# Altium project Fri3D_2018_01.PrjPcb
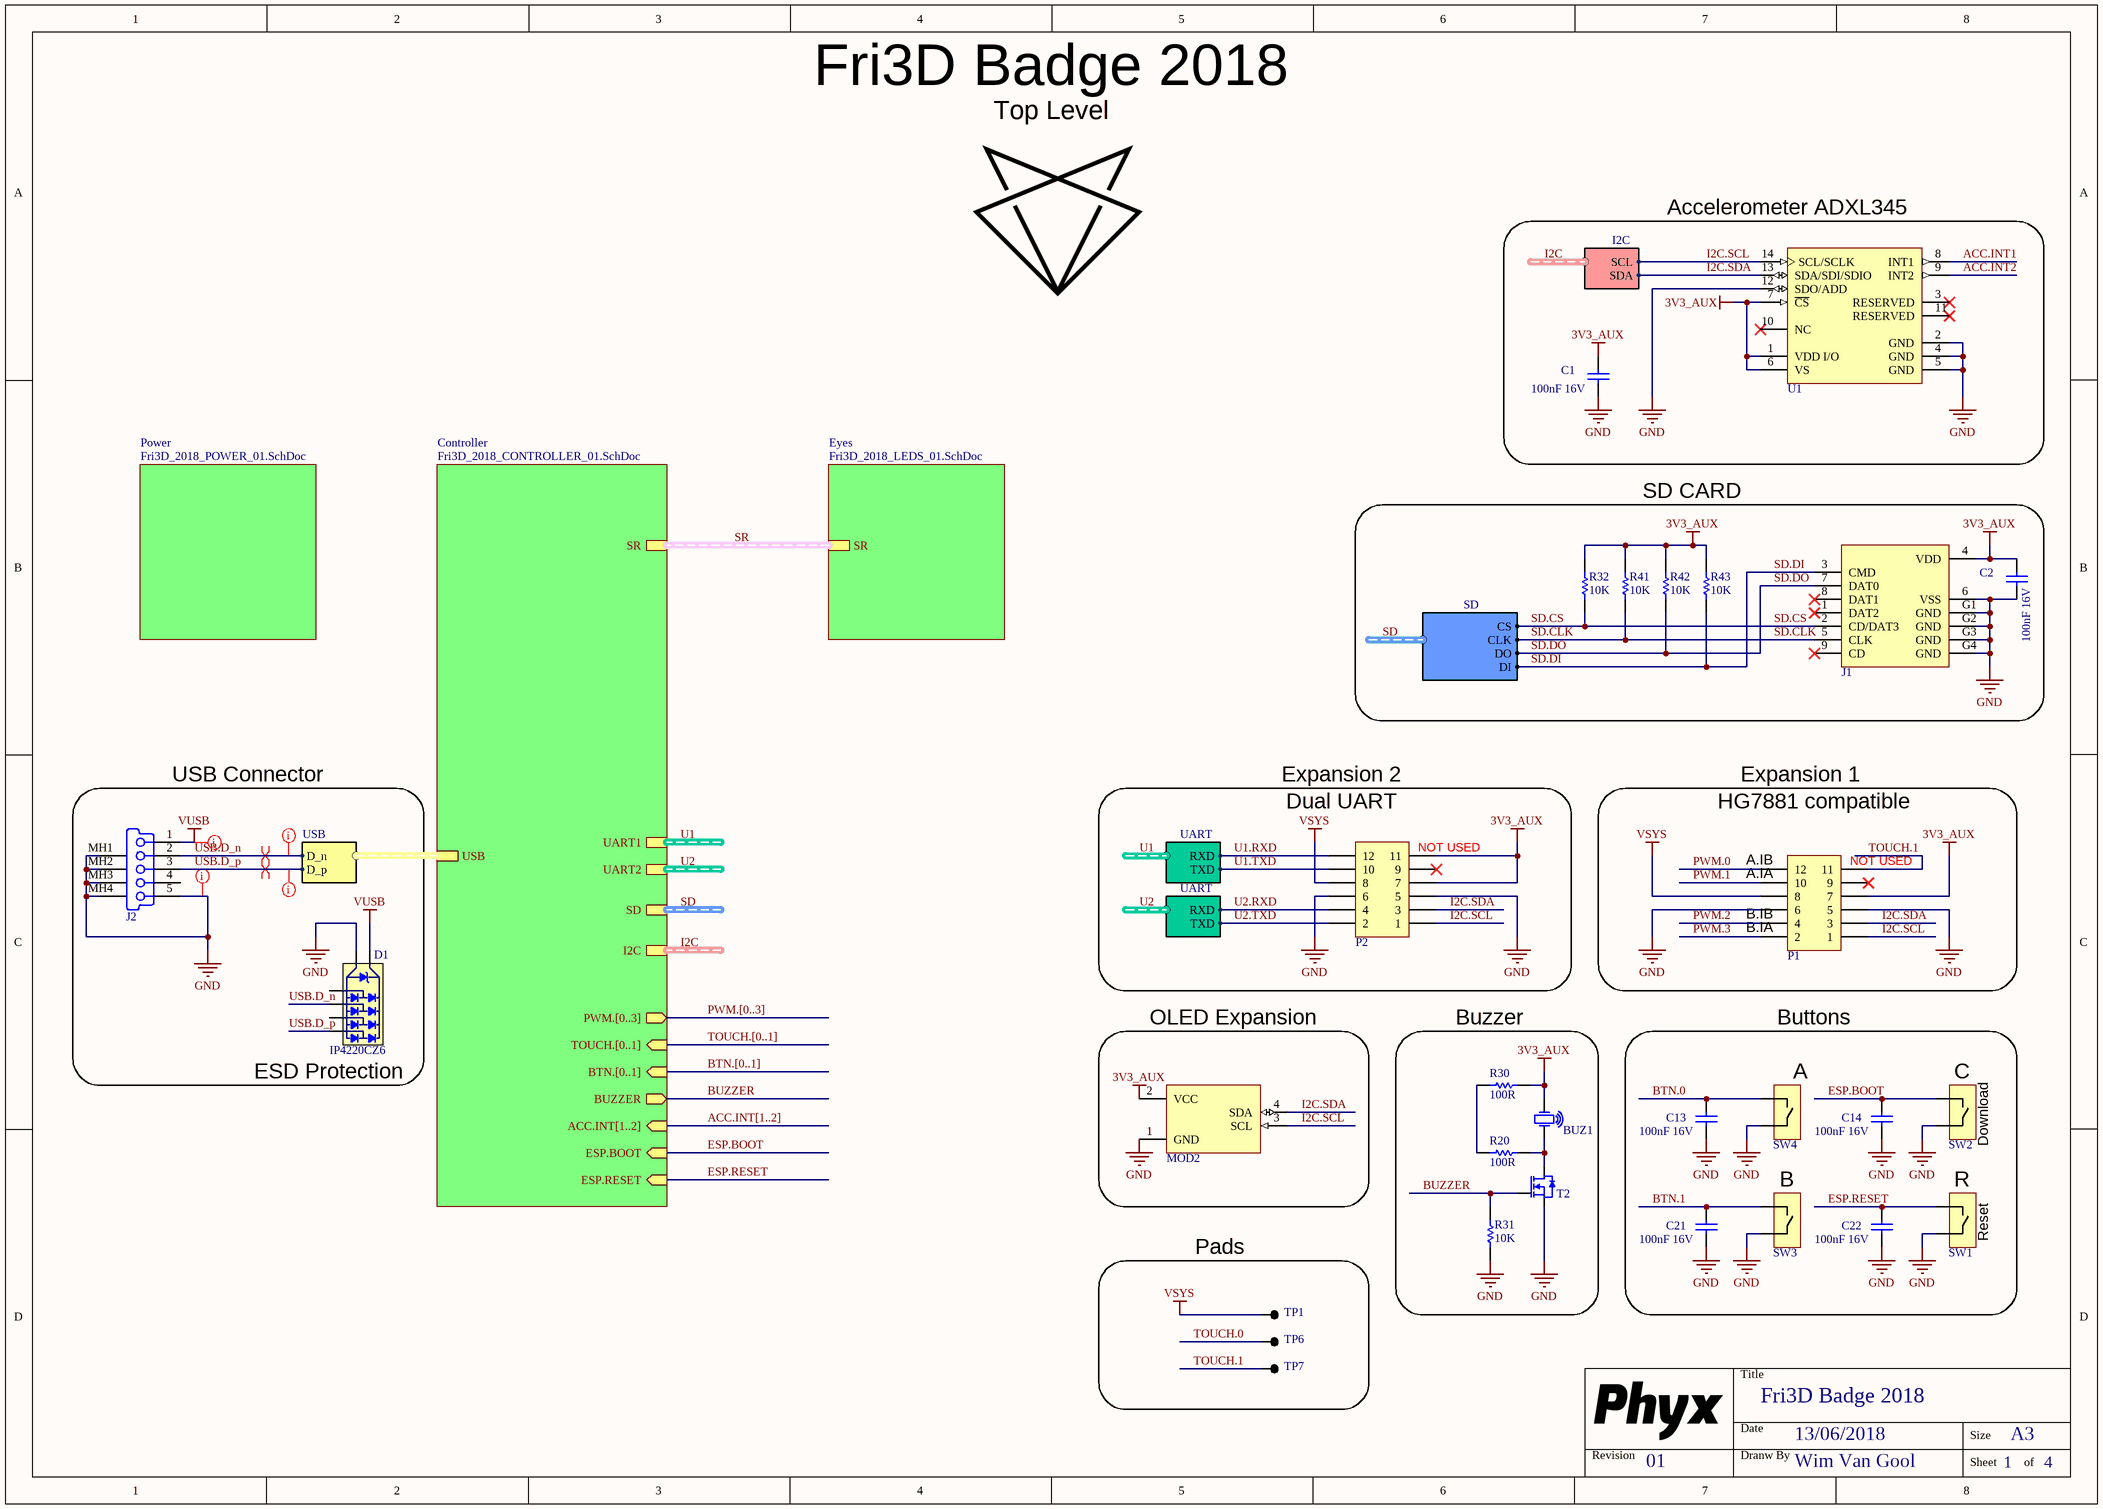
[diagram p0: Fri3D_2018_01.SchDoc]
PCB_ENGINEER: WimVG; PCB_REV: 01; PCB_TITLE: Fri3D Badge 2018
4 sheets, 170 parts. Net scope: hierarchical (ports join the sheet entries above them; power ports are global).
Board file: Fri3D_2018_01.PcbDoc
Sheets:
  Fri3D_2018_01.SchDoc
    Controller = Fri3D_2018_CONTROLLER_01.SchDoc
    Eyes = Fri3D_2018_LEDS_01.SchDoc
    Power = Fri3D_2018_POWER_01.SchDoc

## Sheet Fri3D_2018_01.SchDoc: Fri3D Badge 2018
size A3; Date: 13/06/2018; DrawnBy: Wim Van Gool; DocumentNumber: 1; Revision: 01; SheetNumber: 1; SheetTotal: 4

### Parts
BUZ1  12x12x3mm Piezo Buzzer Transducer 81dB  [CUI_CMT-1203-SMT]  (value not drawn)
C1  value 100nF 16V  [C0603_N]
C2  value 100nF 16V  [C0603_N]
C13  value 100nF 16V  [C0603_N]
C14  value 100nF 16V  [C0603_N]
C21  value 100nF 16V  [C0603_N]
C22  value 100nF 16V  [C0603_N]
D1  value IP4220CZ6  [NXP_SOT457]  (hidden comment: TVS Diode Dual USB)
J1  Micro SD PiPo Push-Push  [TFP09-2-12B]  (value not drawn)
J2  Amphenol FCI 10118194-0001LF Micro USB 1.8A TH Lock  [FCI_10118194-0001LF]  (value not drawn)
MOD2  SSD1306 based 128x64 OLED, I2C, module  [OLED_MOD_0.96_I2C]  (value not drawn)
P1  Receptacle 6x2 SMD low profile  [WE_610312243021_POST]  (value not drawn)
P2  Receptacle 6x2 SMD low profile  [WE_610312243021_POST]  (value not drawn)
R20  value 100R  [R0603_N]  (hidden comment: RESISTOR)
R30  value 100R  [R0603_N]  (hidden comment: RESISTOR)
R31  value 10K  [R0603_N]  (hidden comment: RESISTOR)
R32  value 10K  [R0603_N]  (hidden comment: RESISTOR)
R41  value 10K  [R0603_N]  (hidden comment: RESISTOR)
R42  value 10K  [R0603_N]  (hidden comment: RESISTOR)
R43  value 10K  [R0603_N]  (hidden comment: RESISTOR)
SW1  4.5x4.5mm tact SMD H3,8mm  [WE_430181038816]  (value not drawn)
SW2  4.5x4.5mm tact SMD H3,8mm  [WE_430181038816]  (value not drawn)
SW3  4.5x4.5mm tact SMD H3,8mm  [WE_430181038816]  (value not drawn)
SW4  4.5x4.5mm tact SMD H3,8mm  [WE_430181038816]  (value not drawn)
T2  0.2A N-Ch MOSFET Vgs 3.2  [SOT23-3]  (value not drawn)
TP1  TEST_PAD  [TP_0.8mm]  (value not drawn)
TP6  TEST_PAD  [TP_0.8mm]  (value not drawn)
TP7  TEST_PAD  [TP_0.8mm]  (value not drawn)
U1  3-Axis, ±2 g/±4 g/±8 g/±16 g Digital Accelerometer  [AD_CC-14-1]  (value not drawn)

### Blocks framed on the sheet
Accelerometer ADXL345: C1 U1
SD CARD: C2 J1 R32 R41-R43
OLED Expansion: MOD2
Buzzer: BUZ1 R20 R30 R31 T2
Pads: TP1 TP6 TP7

### Sub-sheets
Controller = Fri3D_2018_CONTROLLER_01.SchDoc: SR (harness Shift Register), USB (harness USB), PWM.[0..3] (out), I2C (harness I2C), SD (harness SD), TOUCH.[0..1] (in), BUZZER (out), BTN.[0..1] (in), ACC.INT[1..2] (in), ESP.RESET (in), UART2 (harness UART), UART1 (harness UART), ESP.BOOT (in)
Eyes = Fri3D_2018_LEDS_01.SchDoc: SR (harness Shift Register)
Power = Fri3D_2018_POWER_01.SchDoc: no entries

### Harnesses
USB: D_p, D_n
I2C: SDA, SCL
SD: CS, CLK, DO, DI
UART: TXD, RXD

### Nets
3V3_AUX: BUZ1.1(OSC1) C1.1 C2.1 J1.4(VDD) MOD2.2(VCC) P1.7 P2.7 P2.11 R30.1 R32.1 R41.1 R42.1 R43.1 U1.1(VDD_I/O) U1.6(VS) U1.7(~{CS})
GND: C1.2 C2.2 C13.2 C14.2 C21.2 C22.2 D1.2(GND) J1.6(VSS) J1.G1(GND) J1.G2(GND) J1.G3(GND) J1.G4(GND) J2.5(GND) J2.MH1(Tab) J2.MH2(Tab) J2.MH3(Tab) J2.MH4(Tab) MOD2.1(GND) P1.5 P1.6 P2.5 P2.6 R31.2 SW1.2 SW2.2 SW3.2 SW4.2 T2.2(S) U1.2(GND) U1.4(GND) U1.5(GND) U1.12(SDO/ADD)
VSYS: P1.8 P2.8 TP1.1
VUSB: D1.5(VBus) J2.1(V_BUS_(5V))
ACC.INT1: U1.8(INT1)
ACC.INT2: U1.9(INT2)
BTN.0: C13.1 SW4.1
BTN.1: C21.1 SW3.1
BUZZER: R31.1 T2.1(G) ; sheet Controller/BUZZER
ESP.BOOT: C14.1 SW2.1 ; sheet Controller/ESP.BOOT
ESP.RESET: C22.1 SW1.1 ; sheet Controller/ESP.RESET
I2C.SCL: MOD2.3(SCL) P1.1 P2.1 U1.14(SCL/SCLK) ; sheet Controller/I2C.SCL
I2C.SDA: MOD2.4(SDA) P1.3 P2.3 U1.13(SDA/SDI/SDIO) ; sheet Controller/I2C.SDA
PWM.0: P1.12
PWM.1: P1.10
PWM.2: P1.4
PWM.3: P1.2
SD.CLK: J1.5(CLK) R41.2 ; sheet Controller/SD.CLK
SD.CS: J1.2(CD/DAT3) R32.2 ; sheet Controller/SD.CS
SD.DI: J1.3(CMD) R43.2 ; sheet Controller/SD.DI
SD.DO: J1.7(DAT0) R42.2 ; sheet Controller/SD.DO
TOUCH.0: TP6.1
TOUCH.1: P1.11 TP7.1
U1.RXD: P2.12 ; sheet Controller/UART1.RXD
U1.TXD: P2.10 ; sheet Controller/UART1.TXD
U2.RXD: P2.4 ; sheet Controller/UART2.RXD
U2.TXD: P2.2 ; sheet Controller/UART2.TXD
USB.D_n: D1.1 J2.2(D-) ; sheet Controller/USB.D_n
USB.D_p: D1.6 J2.3(D+) ; sheet Controller/USB.D_p
NetBUZ1_2: BUZ1.2(OSC2) R20.1 T2.3(D)
NetR20_2: R20.2 R30.2

Not connected (* = marked no-connect by the designer): D1 3 4; J1 1(DAT2)* 8(DAT1)* 9(CD)*; J2 4(NC); P1 9*; P2 9*; U1 3(RESERVED)* 10(NC)* 11(RESERVED)*

### Buses and harness runs
bus ACC.INT[1..2] = sheet Controller/ACC.INT[1..2]
bus BTN.[0..1] = sheet Controller/BTN.[0..1]
bus PWM.[0..3] = sheet Controller/PWM.[0..3]
bus TOUCH.[0..1] = sheet Controller/TOUCH.[0..1]
harness I2C = sheet Controller/I2C
harness SD = sheet Controller/SD
harness SR = sheet Controller/SR = sheet Eyes/SR
harness U1 = sheet Controller/UART1
harness U2 = sheet Controller/UART2

### Layout directives
net class POWER: GND, VUSB
net class 90r: USB.D_n, USB.D_p
differential pair: USB.D_n, USB.D_p

### Notes on the sheet
- Fri3D Badge 2018
- Top Level
- USB Connector
- Expansion 2
- Expansion 1
- (near P2) Dual UART
- (near P2) NOT USED
- HG7881 compatible
- (near P1) A.IB
- (near P1) A.IA
- (near P1) B.IB
- (near P1) NOT USED
- (near P1) B.IA
- Buttons
- (near D1) ESD Protection
- (near SW4) A
- (near SW2) C
- (near SW2) Download
- (near SW3) B
- (near SW1) R
- (near SW1) Reset
- Title
- Revision
- Date
- Dranw By
- Size
- A3
- Sheet
- of

### Library data of the parts
BUZ1 = BUZ # CUI CMT-1203-SMT: Crystal Oscillator; Value: CMT-1203-SMT; Supplier 1: Digikey; Supplier Part Number 1: 102-2197-1-ND; Supplier 2: Aliexpress; Supplier Part Number 2: KLJ-1230
C1 C2 C13 C14 C21 C22 = CAP # 100nF 16V 0603: Capacitor Ceramic
D1 = TVS # IP4220CZ6 Dual USB: =Description; Supplier 1: Farnell; Supplier Part Number 1: 2143248
J1 = MicroSD TFP09-2-12B Push-Push: =Description; Value: TFP09-2-12B; Supplier 1: AliExpress; Supplier Part Number 1: TFP09-2-12B
J2 = USB # Micro B TH Amphenol 10118194-0001LF: Value: 10118194-0001LF; Supplier 1: Farnell; Supplier Part Number 1: 2668482; Supplier 2: Digi-key; Supplier Part Number 2: 609-4618-2-ND
MOD2 = OLED MOD SSD1306 0.96in I2C 128x64: Value: 128x64 I2C OLED; Supplier 1: Aliexpress
P1 P2 = Receptacle # 2.54mm dual row 12way 610312243021: Value: 610312243021; Supplier 1: Wurth; Supplier Part Number 1: 610312243021
R20 R30 = RES # 100R 0603
R31 R32 R41-R43 = RES # 10K 0603: Supplier 1: Farnell; Supplier Part Number 1: 2502397
SW1-SW4 = SW # TACT small 4.5x4.5mm SMD WS-TASV: Value: 430181038816; Supplier 1: Wurth; Supplier Part Number 1: 430181038816
T2 = BSS138 N-Ch MOSFET 0.2A 3.2Vgs 60Vds: Value: BSS138; Supplier 1: Farnell; Supplier Part Number 1: 2432717
TP1 TP6 TP7 = TP # 0.8mm: Value: NO BOM
U1 = ACCELERO # ADXL345: =Description; Value: ADXL345BCCZ; Supplier 1: Farnell; Supplier Part Number 1: 1853935; Supplier 2: Digikey; Supplier Part Number 2: ADXL345BCCZ-ND

## Sheet Fri3D_2018_CONTROLLER_01.SchDoc: Fri3D Badge 2018
size A3; Date: 13/06/2018; DrawnBy: Wim Van Gool; DocumentNumber: 2; Revision: 01; SheetNumber: 2; SheetTotal: 4
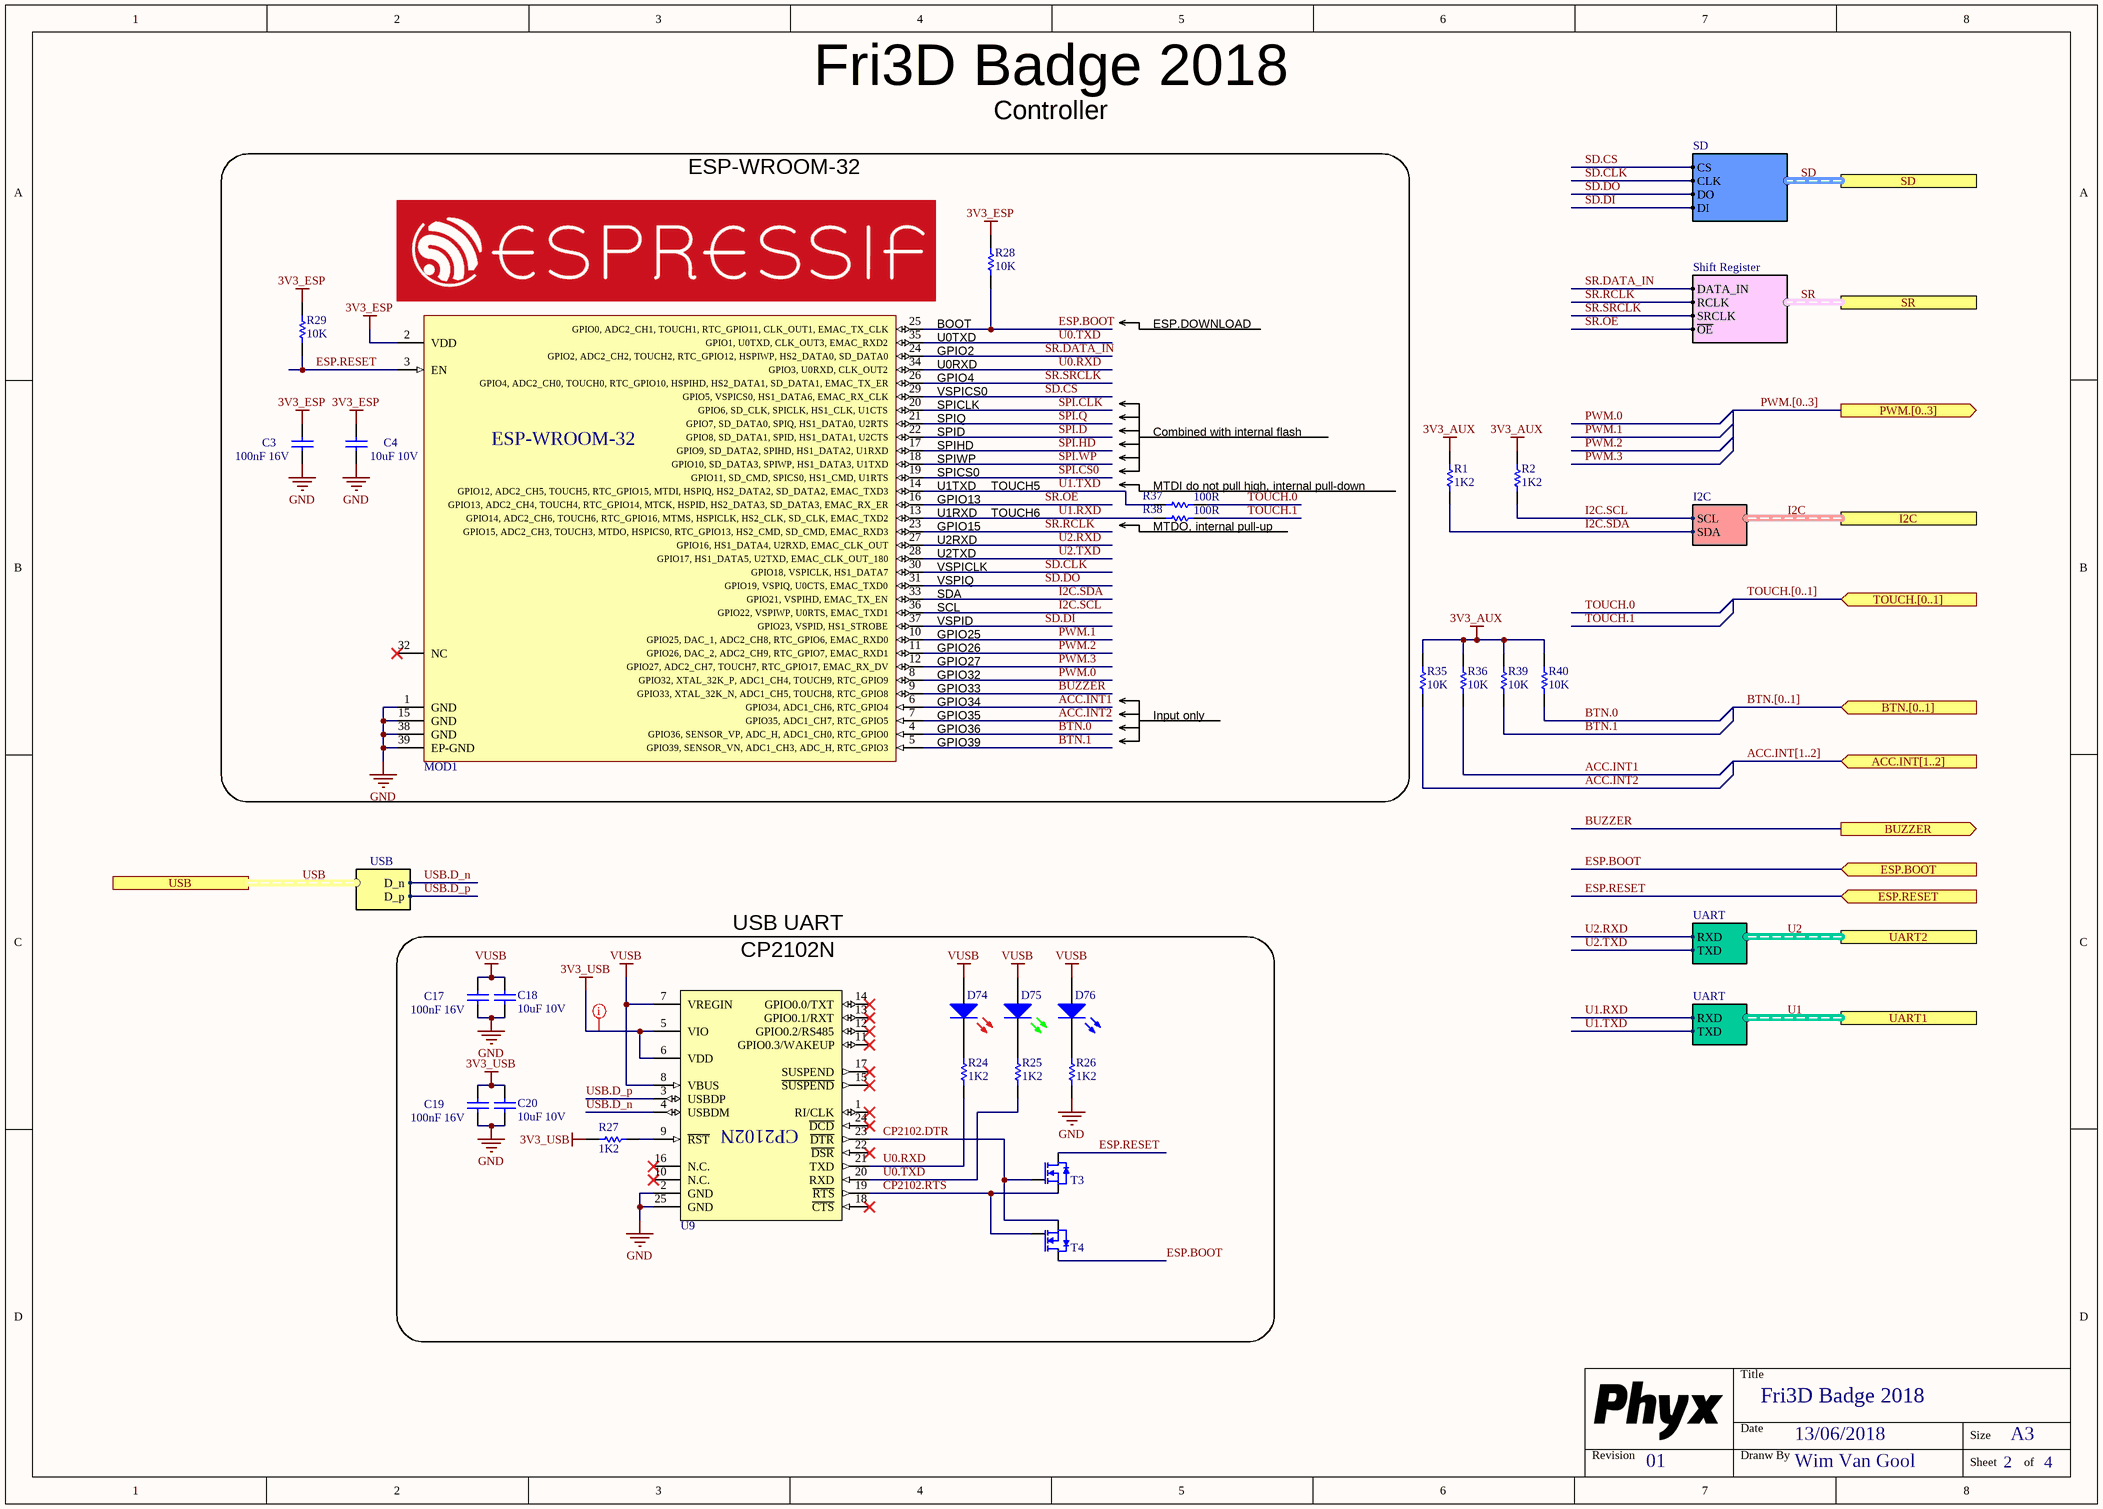
[diagram p1: Fri3D_2018_CONTROLLER_01.SchDoc]

### Parts
C3  value 100nF 16V  [C0603_N]
C4  value 10uF 10V  [C0805_N]  (hidden comment: CAP_CERAMIC)
C17  value 100nF 16V  [C0603_N]
C18  value 10uF 10V  [C0805_N]  (hidden comment: CAP_CERAMIC)
C19  value 100nF 16V  [C0603_N]
C20  value 10uF 10V  [C0805_N]  (hidden comment: CAP_CERAMIC)
D74  Default 0805 Red LED  [LED_0805_RD]  (value not drawn)
D75  Default 0805 Green LED  [LED_0805_GR]  (value not drawn)
D76  Default 0805 Blue LED  [LED_0805_BL]  (value not drawn)
MOD1  ESP-32 based ESP-WROOM-32  [ESP-WROOM-32]  (value not drawn)
R1  value 1K2  [R0603_N]  (hidden comment: RESISTOR)
R2  value 1K2  [R0603_N]  (hidden comment: RESISTOR)
R24  value 1K2  [R0603_N]  (hidden comment: RESISTOR)
R25  value 1K2  [R0603_N]  (hidden comment: RESISTOR)
R26  value 1K2  [R0603_N]  (hidden comment: RESISTOR)
R27  value 1K2  [R0603_N]  (hidden comment: RESISTOR)
R28  value 10K  [R0603_N]  (hidden comment: RESISTOR)
R29  value 10K  [R0603_N]  (hidden comment: RESISTOR)
R35  value 10K  [R0603_N]  (hidden comment: RESISTOR)
R36  value 10K  [R0603_N]  (hidden comment: RESISTOR)
R37  value 100R  [R0603_N]  (hidden comment: RESISTOR)
R38  value 100R  [R0603_N]  (hidden comment: RESISTOR)
R39  value 10K  [R0603_N]  (hidden comment: RESISTOR)
R40  value 10K  [R0603_N]  (hidden comment: RESISTOR)
T3  0.2A N-Ch MOSFET Vgs 3.2  [SOT23-3]  (value not drawn)
T4  0.2A N-Ch MOSFET Vgs 3.2  [SOT23-3]  (value not drawn)
U9  USB to UART 3.3-5V  [QFN_24]  (value not drawn)

### Blocks framed on the sheet
ESP-WROOM-32: C3 C4 MOD1 R28 R29 R37 R38

### Ports
ACC.INT[1..2] (in), BTN.[0..1] (in), BUZZER (out), ESP.BOOT (in), ESP.RESET (in), I2C (harness I2C), PWM.[0..3] (out), SD (harness SD), SR (harness Shift Register), TOUCH.[0..1] (in), UART1 (harness UART), UART2 (harness UART), USB (harness USB)

### Harnesses
Shift Register: DATA_IN, RCLK, SRCLK, ~{OE}
USB: D_p, D_n
I2C: SDA, SCL
SD: CS, CLK, DO, DI
UART: TXD, RXD

### Nets
3V3_AUX: R1.1 R2.1 R35.1 R36.1 R39.1 R40.1
3V3_ESP: C3.1 C4.1 MOD1.2(VDD) R28.1 R29.1
3V3_USB: C19.1 C20.2 R27.1 U9.5(VIO) U9.6(VDD)
GND: C3.2 C4.2 C17.2 C18.1 C19.2 C20.1 MOD1.1(GND) MOD1.15(GND) MOD1.38(GND) MOD1.39(EP-GND) R26.2 U9.2(GND) U9.25(GND)
VUSB: C17.1 C18.2 D74.1(A) D75.1(A) D76.1(A) U9.7(VREGIN) U9.8(VBUS)
ACC.INT1: MOD1.6(GPIO34,_ADC1_CH6,_RTC_GPIO4) R36.2
ACC.INT2: MOD1.7(GPIO35,_ADC1_CH7,_RTC_GPIO5) R35.2
BTN.0: MOD1.4(GPIO36,_SENSOR_VP,_ADC_H,_ADC1_CH0,_RTC_GPIO0) R40.2
BTN.1: MOD1.5(GPIO39,_SENSOR_VN,_ADC1_CH3,_ADC_H,_RTC_GPIO3) R39.2
BUZZER: MOD1.9(GPIO33,_XTAL_32K_N,_ADC1_CH5,_TOUCH8,_RTC_GPIO8) ; port BUZZER
CP2102.DTR: T3.1(G) T4.2(S) U9.23(~{DTR})
CP2102.RTS: T3.2(S) T4.1(G) U9.19(~{RTS})
ESP.BOOT: MOD1.25(GPIO0,_ADC2_CH1,_TOUCH1,_RTC_GPIO11,_CLK_OUT1,_EMAC_TX_CLK) R28.2 T4.3(D) ; port ESP.BOOT
ESP.RESET: MOD1.3(EN) R29.2 T3.3(D) ; port ESP.RESET
I2C.SCL: MOD1.36(GPIO22,_VSPIWP,_U0RTS,_EMAC_TXD1) R2.2 ; port I2C.SCL
I2C.SDA: MOD1.33(GPIO21,_VSPIHD,_EMAC_TX_EN) R1.2 ; port I2C.SDA
PWM.0: MOD1.8(GPIO32,_XTAL_32K_P,_ADC1_CH4,_TOUCH9,_RTC_GPIO9)
PWM.1: MOD1.10(GPIO25,_DAC_1,_ADC2_CH8,_RTC_GPIO6,_EMAC_RXD0)
PWM.2: MOD1.11(GPIO26,_DAC_2,_ADC2_CH9,_RTC_GPIO7,_EMAC_RXD1)
PWM.3: MOD1.12(GPIO27,_ADC2_CH7,_TOUCH7,_RTC_GPIO17,_EMAC_RX_DV)
SD.CLK: MOD1.30(GPIO18,_VSPICLK,_HS1_DATA7) ; port SD.CLK
SD.CS: MOD1.29(GPIO5,_VSPICS0,_HS1_DATA6,_EMAC_RX_CLK) ; port SD.CS
SD.DI: MOD1.37(GPIO23,_VSPID,_HS1_STROBE) ; port SD.DI
SD.DO: MOD1.31(GPIO19,_VSPIQ,_U0CTS,_EMAC_TXD0) ; port SD.DO
SPI.CLK: MOD1.20(GPIO6,_SD_CLK,_SPICLK,_HS1_CLK,_U1CTS)
SPI.CS0: MOD1.19(GPIO11,_SD_CMD,_SPICS0,_HS1_CMD,_U1RTS)
SPI.D: MOD1.22(GPIO8,_SD_DATA1,_SPID,_HS1_DATA1,_U2CTS)
SPI.HD: MOD1.17(GPIO9,_SD_DATA2,_SPIHD,_HS1_DATA2,_U1RXD)
SPI.Q: MOD1.21(GPIO7,_SD_DATA0,_SPIQ,_HS1_DATA0,_U2RTS)
SPI.WP: MOD1.18(GPIO10,_SD_DATA3,_SPIWP,_HS1_DATA3,_U1TXD)
SR.DATA_IN: MOD1.24(GPIO2,_ADC2_CH2,_TOUCH2,_RTC_GPIO12,_HSPIWP,_HS2_DATA0,_SD_DATA0) ; port SR.DATA_IN
SR.~{OE}: MOD1.16(GPIO13,_ADC2_CH4,_TOUCH4,_RTC_GPIO14,_MTCK,_HSPID,_HS2_DATA3,_SD_DATA3,_EMAC_RX_ER) ; port SR.~{OE}
SR.RCLK: MOD1.23(GPIO15,_ADC2_CH3,_TOUCH3,_MTDO,_HSPICS0,_RTC_GPIO13,_HS2_CMD,_SD_CMD,_EMAC_RXD3) ; port SR.RCLK
SR.SRCLK: MOD1.26(GPIO4,_ADC2_CH0,_TOUCH0,_RTC_GPIO10,_HSPIHD,_HS2_DATA1,_SD_DATA1,_EMAC_TX_ER) ; port SR.SRCLK
TOUCH.0: R37.2
TOUCH.1: R38.2
U0.RXD: MOD1.34(GPIO3,_U0RXD,_CLK_OUT2) R24.2 U9.21(TXD)
U0.TXD: MOD1.35(GPIO1,_U0TXD,_CLK_OUT3,_EMAC_RXD2) R25.2 U9.20(RXD)
U1.RXD: MOD1.13(GPIO14,_ADC2_CH6,_TOUCH6,_RTC_GPIO16,_MTMS,_HSPICLK,_HS2_CLK,_SD_CLK,_EMAC_TXD2) R38.1 ; port UART1.RXD
U1.TXD: MOD1.14(GPIO12,_ADC2_CH5,_TOUCH5,_RTC_GPIO15,_MTDI,_HSPIQ,_HS2_DATA2,_SD_DATA2,_EMAC_TXD3) R37.1 ; port UART1.TXD
U2.RXD: MOD1.27(GPIO16,_HS1_DATA4,_U2RXD,_EMAC_CLK_OUT) ; port UART2.RXD
U2.TXD: MOD1.28(GPIO17,_HS1_DATA5,_U2TXD,_EMAC_CLK_OUT_180) ; port UART2.TXD
USB.D_n: U9.4(USBDM) ; port USB.D_n
USB.D_p: U9.3(USBDP) ; port USB.D_p
NetD74_2: D74.2(K) R24.1
NetD75_2: D75.2(K) R25.1
NetD76_2: D76.2(K) R26.1
NetR27_2: R27.2 U9.9(~{RST})

Not connected (* = marked no-connect by the designer): MOD1 32(NC)*; U9 1(RI/CLK)* 10(N.C.)* 11(GPIO0.3/WAKEUP)* 12(GPIO0.2/RS485)* 13(GPIO0.1/RXT)* 14(GPIO0.0/TXT)* 15(~{SUSPEND})* 16(N.C.)* 17(SUSPEND)* 18(~{CTS})* 22(~{DSR})* 24(~{DCD})*

### Buses and harness runs
bus ACC.INT[1..2] = port ACC.INT[1..2]
bus BTN.[0..1] = port BTN.[0..1]
bus PWM.[0..3] = port PWM.[0..3]
bus TOUCH.[0..1] = port TOUCH.[0..1]
harness I2C = port I2C
harness SD = port SD
harness SR = port SR
harness U1 = port UART1
harness U2 = port UART2
harness USB = port USB

### Layout directives
net class POWER: 3V3_USB

### Notes on the sheet
- Fri3D Badge 2018
- Controller
- BOOT
- ESP.DOWNLOAD
- (near MOD1) VSPICS0
- U0TXD
- (near MOD1) U0RXD
- (near MOD1) GPIO2
- (near MOD1) GPIO4
- (near MOD1) SPICLK
- (near MOD1) SPIQ
- (near MOD1) SPID
- (near MOD1) SPIHD
- (near MOD1) SPIWP
- Combined with internal flash
- (near MOD1) SPICS0
- (near MOD1) U1TXD
- (near MOD1) U1RXD
- (near MOD1) GPIO15
- (near MOD1) GPIO13
- TOUCH5
- TOUCH6
- (near R37) MTDI do not pull high, internal pull-down
- (near R38) MTDO, internal pull-up
- (near MOD1) SDA
- (near MOD1) VSPICLK
- (near MOD1) VSPIQ
- (near MOD1) U2TXD
- (near MOD1) U2RXD
- (near MOD1) SCL
- (near MOD1) VSPID
- (near MOD1) GPIO25
- (near MOD1) GPIO26
- (near MOD1) GPIO27
- (near MOD1) GPIO32
- (near MOD1) GPIO33
- (near MOD1) GPIO34
- (near MOD1) GPIO35
- (near MOD1) GPIO36
- Input only
- (near MOD1) GPIO39
- USB UART
- (near U9) CP2102N
- Title
- Revision
- Date
- Dranw By
- Size
- A3
- Sheet
- of
- (in symbol CP2102N # QFN24 USB UART) CP2102N

### Library data of the parts
C3 C17 C19 = CAP # 100nF 16V 0603: Capacitor Ceramic
C4 C18 C20 = CAP # 10uF 10V 0805: Capacitor Ceramic; Supplier 1: Farnell; Supplier Part Number 1: 2320859
D74 = LED # Red 0805: =Description; Supplier 1: Farnell; Supplier Part Number 1: 2099236
D75 = LED # Green 0805: =Description; Supplier 1: Farnell; Supplier Part Number 1: 2099239
D76 = LED # Blue 0805: =Description; Supplier 1: Farnell; Supplier Part Number 1: 2217980
MOD1 = WiFi # MOD ESP-WROOM-32: Value: ESP-WROOM-32; Supplier 1: Espressif; Supplier Part Number 1: ESP-WROOM-32
R1 R2 R24-R27 = RES # 1K2 0603
R28 R29 R35 R36 R39 R40 = RES # 10K 0603: Supplier 1: Farnell; Supplier Part Number 1: 2502397
R37 R38 = RES # 100R 0603
T3 T4 = BSS138 N-Ch MOSFET 0.2A 3.2Vgs 60Vds: Value: BSS138; Supplier 1: Farnell; Supplier Part Number 1: 2432717
U9 = CP2102N # QFN24 USB UART: =Description; Value: CP2102N-A01-GQFN24; Supplier 1: Farnell; Supplier Part Number 1: 2577278; Supplier 2: Digikey; Supplier Part Number 2: 336-3693-ND

## Sheet Fri3D_2018_LEDS_01.SchDoc: Fri3D Badge 2018
size A3; Date: 13/06/2018; DrawnBy: Wim Van Gool; DocumentNumber: 3; Revision: 01; SheetNumber: 3; SheetTotal: 4
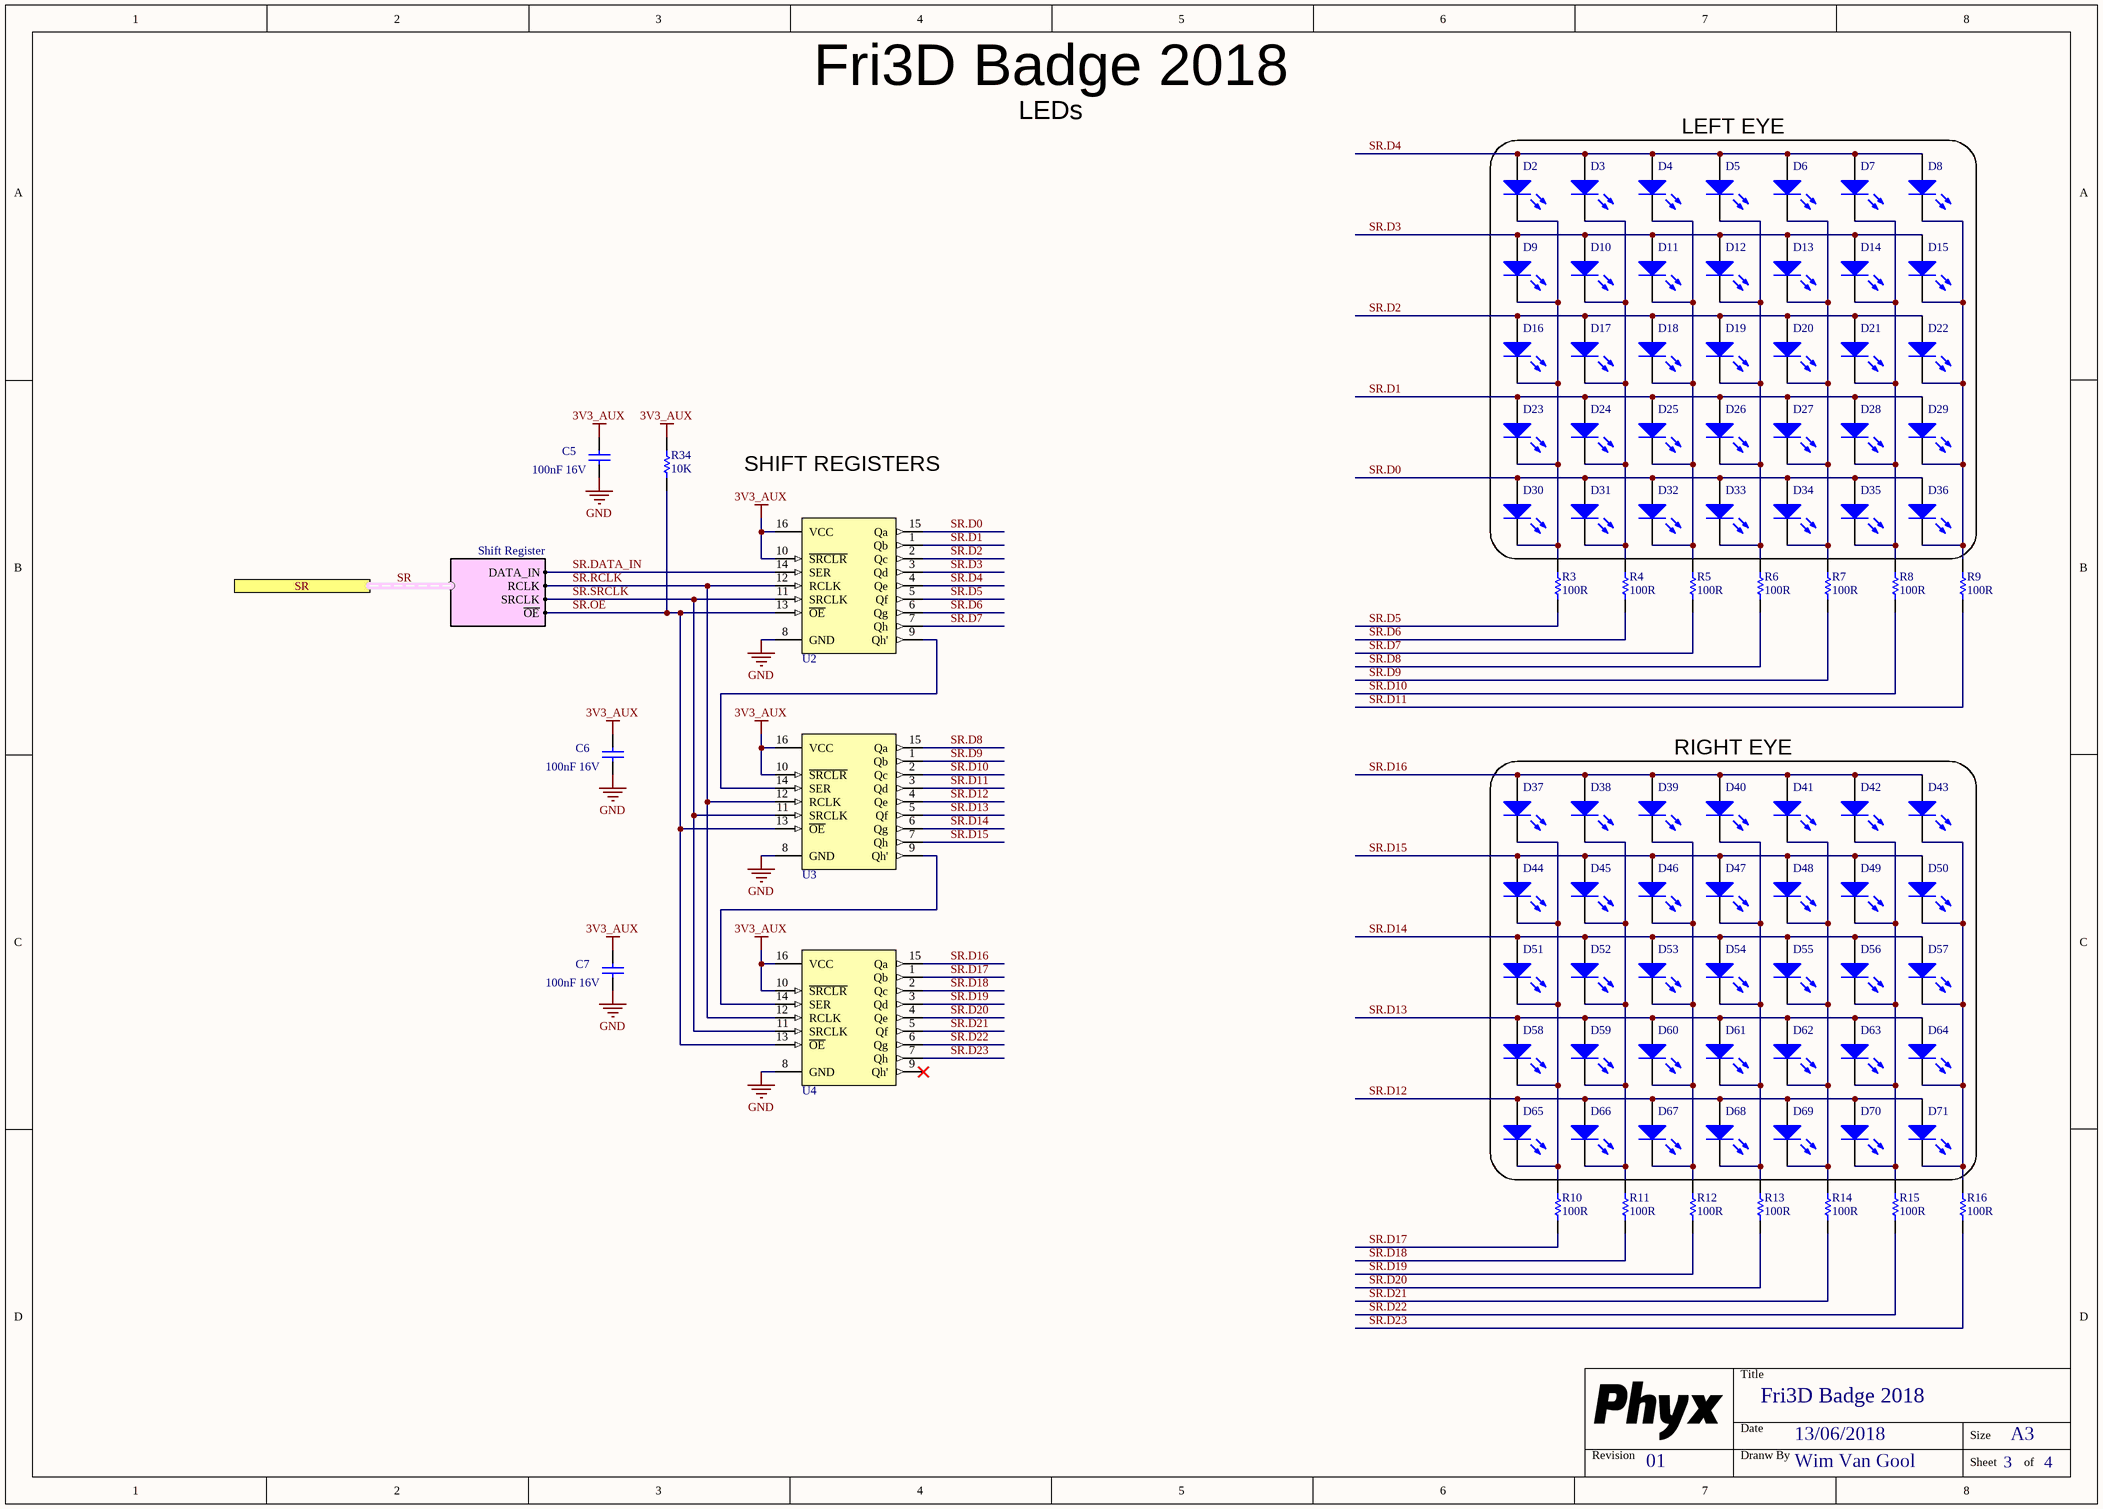
[diagram p2: Fri3D_2018_LEDS_01.SchDoc]

### Parts
C5  value 100nF 16V  [C0603_N]
C6  value 100nF 16V  [C0603_N]
C7  value 100nF 16V  [C0603_N]
D2  Default 0805 Blue LED  [LED_0805_BL]  (value not drawn)
D3  Default 0805 Blue LED  [LED_0805_BL]  (value not drawn)
D4  Default 0805 Blue LED  [LED_0805_BL]  (value not drawn)
D5  Default 0805 Blue LED  [LED_0805_BL]  (value not drawn)
D6  Default 0805 Blue LED  [LED_0805_BL]  (value not drawn)
D7  Default 0805 Blue LED  [LED_0805_BL]  (value not drawn)
D8  Default 0805 Blue LED  [LED_0805_BL]  (value not drawn)
D9  Default 0805 Blue LED  [LED_0805_BL]  (value not drawn)
D10  Default 0805 Blue LED  [LED_0805_BL]  (value not drawn)
D11  Default 0805 Blue LED  [LED_0805_BL]  (value not drawn)
D12  Default 0805 Blue LED  [LED_0805_BL]  (value not drawn)
D13  Default 0805 Blue LED  [LED_0805_BL]  (value not drawn)
D14  Default 0805 Blue LED  [LED_0805_BL]  (value not drawn)
D15  Default 0805 Blue LED  [LED_0805_BL]  (value not drawn)
D16  Default 0805 Blue LED  [LED_0805_BL]  (value not drawn)
D17  Default 0805 Blue LED  [LED_0805_BL]  (value not drawn)
D18  Default 0805 Blue LED  [LED_0805_BL]  (value not drawn)
D19  Default 0805 Blue LED  [LED_0805_BL]  (value not drawn)
D20  Default 0805 Blue LED  [LED_0805_BL]  (value not drawn)
D21  Default 0805 Blue LED  [LED_0805_BL]  (value not drawn)
D22  Default 0805 Blue LED  [LED_0805_BL]  (value not drawn)
D23  Default 0805 Blue LED  [LED_0805_BL]  (value not drawn)
D24  Default 0805 Blue LED  [LED_0805_BL]  (value not drawn)
D25  Default 0805 Blue LED  [LED_0805_BL]  (value not drawn)
D26  Default 0805 Blue LED  [LED_0805_BL]  (value not drawn)
D27  Default 0805 Blue LED  [LED_0805_BL]  (value not drawn)
D28  Default 0805 Blue LED  [LED_0805_BL]  (value not drawn)
D29  Default 0805 Blue LED  [LED_0805_BL]  (value not drawn)
D30  Default 0805 Blue LED  [LED_0805_BL]  (value not drawn)
D31  Default 0805 Blue LED  [LED_0805_BL]  (value not drawn)
D32  Default 0805 Blue LED  [LED_0805_BL]  (value not drawn)
D33  Default 0805 Blue LED  [LED_0805_BL]  (value not drawn)
D34  Default 0805 Blue LED  [LED_0805_BL]  (value not drawn)
D35  Default 0805 Blue LED  [LED_0805_BL]  (value not drawn)
D36  Default 0805 Blue LED  [LED_0805_BL]  (value not drawn)
D37  Default 0805 Blue LED  [LED_0805_BL]  (value not drawn)
D38  Default 0805 Blue LED  [LED_0805_BL]  (value not drawn)
D39  Default 0805 Blue LED  [LED_0805_BL]  (value not drawn)
D40  Default 0805 Blue LED  [LED_0805_BL]  (value not drawn)
D41  Default 0805 Blue LED  [LED_0805_BL]  (value not drawn)
D42  Default 0805 Blue LED  [LED_0805_BL]  (value not drawn)
D43  Default 0805 Blue LED  [LED_0805_BL]  (value not drawn)
D44  Default 0805 Blue LED  [LED_0805_BL]  (value not drawn)
D45  Default 0805 Blue LED  [LED_0805_BL]  (value not drawn)
D46  Default 0805 Blue LED  [LED_0805_BL]  (value not drawn)
D47  Default 0805 Blue LED  [LED_0805_BL]  (value not drawn)
D48  Default 0805 Blue LED  [LED_0805_BL]  (value not drawn)
D49  Default 0805 Blue LED  [LED_0805_BL]  (value not drawn)
D50  Default 0805 Blue LED  [LED_0805_BL]  (value not drawn)
D51  Default 0805 Blue LED  [LED_0805_BL]  (value not drawn)
D52  Default 0805 Blue LED  [LED_0805_BL]  (value not drawn)
D53  Default 0805 Blue LED  [LED_0805_BL]  (value not drawn)
D54  Default 0805 Blue LED  [LED_0805_BL]  (value not drawn)
D55  Default 0805 Blue LED  [LED_0805_BL]  (value not drawn)
D56  Default 0805 Blue LED  [LED_0805_BL]  (value not drawn)
D57  Default 0805 Blue LED  [LED_0805_BL]  (value not drawn)
D58  Default 0805 Blue LED  [LED_0805_BL]  (value not drawn)
D59  Default 0805 Blue LED  [LED_0805_BL]  (value not drawn)
D60  Default 0805 Blue LED  [LED_0805_BL]  (value not drawn)
D61  Default 0805 Blue LED  [LED_0805_BL]  (value not drawn)
D62  Default 0805 Blue LED  [LED_0805_BL]  (value not drawn)
D63  Default 0805 Blue LED  [LED_0805_BL]  (value not drawn)
D64  Default 0805 Blue LED  [LED_0805_BL]  (value not drawn)
D65  Default 0805 Blue LED  [LED_0805_BL]  (value not drawn)
D66  Default 0805 Blue LED  [LED_0805_BL]  (value not drawn)
D67  Default 0805 Blue LED  [LED_0805_BL]  (value not drawn)
D68  Default 0805 Blue LED  [LED_0805_BL]  (value not drawn)
D69  Default 0805 Blue LED  [LED_0805_BL]  (value not drawn)
D70  Default 0805 Blue LED  [LED_0805_BL]  (value not drawn)
D71  Default 0805 Blue LED  [LED_0805_BL]  (value not drawn)
R3  value 100R  [R0603_N]  (hidden comment: RESISTOR)
R4  value 100R  [R0603_N]  (hidden comment: RESISTOR)
R5  value 100R  [R0603_N]  (hidden comment: RESISTOR)
R6  value 100R  [R0603_N]  (hidden comment: RESISTOR)
R7  value 100R  [R0603_N]  (hidden comment: RESISTOR)
R8  value 100R  [R0603_N]  (hidden comment: RESISTOR)
R9  value 100R  [R0603_N]  (hidden comment: RESISTOR)
R10  value 100R  [R0603_N]  (hidden comment: RESISTOR)
R11  value 100R  [R0603_N]  (hidden comment: RESISTOR)
R12  value 100R  [R0603_N]  (hidden comment: RESISTOR)
R13  value 100R  [R0603_N]  (hidden comment: RESISTOR)
R14  value 100R  [R0603_N]  (hidden comment: RESISTOR)
R15  value 100R  [R0603_N]  (hidden comment: RESISTOR)
R16  value 100R  [R0603_N]  (hidden comment: RESISTOR)
R34  value 10K  [R0603_N]  (hidden comment: RESISTOR)
U2  8-Bit Shift Registers With 3-State Output Registers  [SOIC_N_16]  (value not drawn)
U3  8-Bit Shift Registers With 3-State Output Registers  [SOIC_N_16]  (value not drawn)
U4  8-Bit Shift Registers With 3-State Output Registers  [SOIC_N_16]  (value not drawn)

### Blocks framed on the sheet
LEFT EYE: D2-D36
RIGHT EYE: D37-D71

### Ports
SR (harness Shift Register)

### Harnesses
Shift Register: DATA_IN, RCLK, SRCLK, ~{OE}

### Nets
3V3_AUX: C5.1 C6.1 C7.1 R34.1 U2.10(~{SRCLR}) U2.16(VCC) U3.10(~{SRCLR}) U3.16(VCC) U4.10(~{SRCLR}) U4.16(VCC)
GND: C5.2 C6.2 C7.2 U2.8(GND) U3.8(GND) U4.8(GND)
SR.D0: D30.1(A) D31.1(A) D32.1(A) D33.1(A) D34.1(A) D35.1(A) D36.1(A) U2.15(Qa)
SR.D1: D23.1(A) D24.1(A) D25.1(A) D26.1(A) D27.1(A) D28.1(A) D29.1(A) U2.1(Qb)
SR.D2: D16.1(A) D17.1(A) D18.1(A) D19.1(A) D20.1(A) D21.1(A) D22.1(A) U2.2(Qc)
SR.D3: D9.1(A) D10.1(A) D11.1(A) D12.1(A) D13.1(A) D14.1(A) D15.1(A) U2.3(Qd)
SR.D4: D2.1(A) D3.1(A) D4.1(A) D5.1(A) D6.1(A) D7.1(A) D8.1(A) U2.4(Qe)
SR.D5: R3.2 U2.5(Qf)
SR.D6: R4.2 U2.6(Qg)
SR.D7: R5.2 U2.7(Qh)
SR.D8: R6.2 U3.15(Qa)
SR.D9: R7.2 U3.1(Qb)
SR.D10: R8.2 U3.2(Qc)
SR.D11: R9.2 U3.3(Qd)
SR.D12: D65.1(A) D66.1(A) D67.1(A) D68.1(A) D69.1(A) D70.1(A) D71.1(A) U3.4(Qe)
SR.D13: D58.1(A) D59.1(A) D60.1(A) D61.1(A) D62.1(A) D63.1(A) D64.1(A) U3.5(Qf)
SR.D14: D51.1(A) D52.1(A) D53.1(A) D54.1(A) D55.1(A) D56.1(A) D57.1(A) U3.6(Qg)
SR.D15: D44.1(A) D45.1(A) D46.1(A) D47.1(A) D48.1(A) D49.1(A) D50.1(A) U3.7(Qh)
SR.D16: D37.1(A) D38.1(A) D39.1(A) D40.1(A) D41.1(A) D42.1(A) D43.1(A) U4.15(Qa)
SR.D17: R10.2 U4.1(Qb)
SR.D18: R11.2 U4.2(Qc)
SR.D19: R12.2 U4.3(Qd)
SR.D20: R13.2 U4.4(Qe)
SR.D21: R14.2 U4.5(Qf)
SR.D22: R15.2 U4.6(Qg)
SR.D23: R16.2 U4.7(Qh)
SR.DATA_IN: U2.14(SER) ; port SR.DATA_IN
SR.~{OE}: R34.2 U2.13(~{OE}) U3.13(~{OE}) U4.13(~{OE}) ; port SR.~{OE}
SR.RCLK: U2.12(RCLK) U3.12(RCLK) U4.12(RCLK) ; port SR.RCLK
SR.SRCLK: U2.11(SRCLK) U3.11(SRCLK) U4.11(SRCLK) ; port SR.SRCLK
NetD2_2: D2.2(K) D9.2(K) D16.2(K) D23.2(K) D30.2(K) R3.1
NetD3_2: D3.2(K) D10.2(K) D17.2(K) D24.2(K) D31.2(K) R4.1
NetD4_2: D4.2(K) D11.2(K) D18.2(K) D25.2(K) D32.2(K) R5.1
NetD5_2: D5.2(K) D12.2(K) D19.2(K) D26.2(K) D33.2(K) R6.1
NetD6_2: D6.2(K) D13.2(K) D20.2(K) D27.2(K) D34.2(K) R7.1
NetD7_2: D7.2(K) D14.2(K) D21.2(K) D28.2(K) D35.2(K) R8.1
NetD8_2: D8.2(K) D15.2(K) D22.2(K) D29.2(K) D36.2(K) R9.1
NetD37_2: D37.2(K) D44.2(K) D51.2(K) D58.2(K) D65.2(K) R10.1
NetD38_2: D38.2(K) D45.2(K) D52.2(K) D59.2(K) D66.2(K) R11.1
NetD39_2: D39.2(K) D46.2(K) D53.2(K) D60.2(K) D67.2(K) R12.1
NetD40_2: D40.2(K) D47.2(K) D54.2(K) D61.2(K) D68.2(K) R13.1
NetD41_2: D41.2(K) D48.2(K) D55.2(K) D62.2(K) D69.2(K) R14.1
NetD42_2: D42.2(K) D49.2(K) D56.2(K) D63.2(K) D70.2(K) R15.1
NetD43_2: D43.2(K) D50.2(K) D57.2(K) D64.2(K) D71.2(K) R16.1
NetU2_9: U2.9(Qh') U3.14(SER)
NetU3_9: U3.9(Qh') U4.14(SER)

Not connected (* = marked no-connect by the designer): U4 9(Qh')*

### Buses and harness runs
harness SR = port SR

### Notes on the sheet
- Fri3D Badge 2018
- LEDs
- SHIFT REGISTERS
- Title
- Revision
- Date
- Dranw By
- Size
- A3
- Sheet
- of

### Library data of the parts
C5-C7 = CAP # 100nF 16V 0603: Capacitor Ceramic
D2-D71 = LED # Blue 0805: =Description; Supplier 1: Farnell; Supplier Part Number 1: 2217980
R3-R16 = RES # 100R 0603
R34 = RES # 10K 0603: Supplier 1: Farnell; Supplier Part Number 1: 2502397
U2-U4 = IOEXP # SHIFT 74HC595 8-bit: =Description; Value: 74HC595; Supplier 1: Farnell; Supplier Part Number 1: 1278491

## Sheet Fri3D_2018_POWER_01.SchDoc: Fri3D Badge 2018
size A3; Date: 13/06/2018; DrawnBy: Wim Van Gool; DocumentNumber: 4; Revision: 01; SheetNumber: 4; SheetTotal: 4
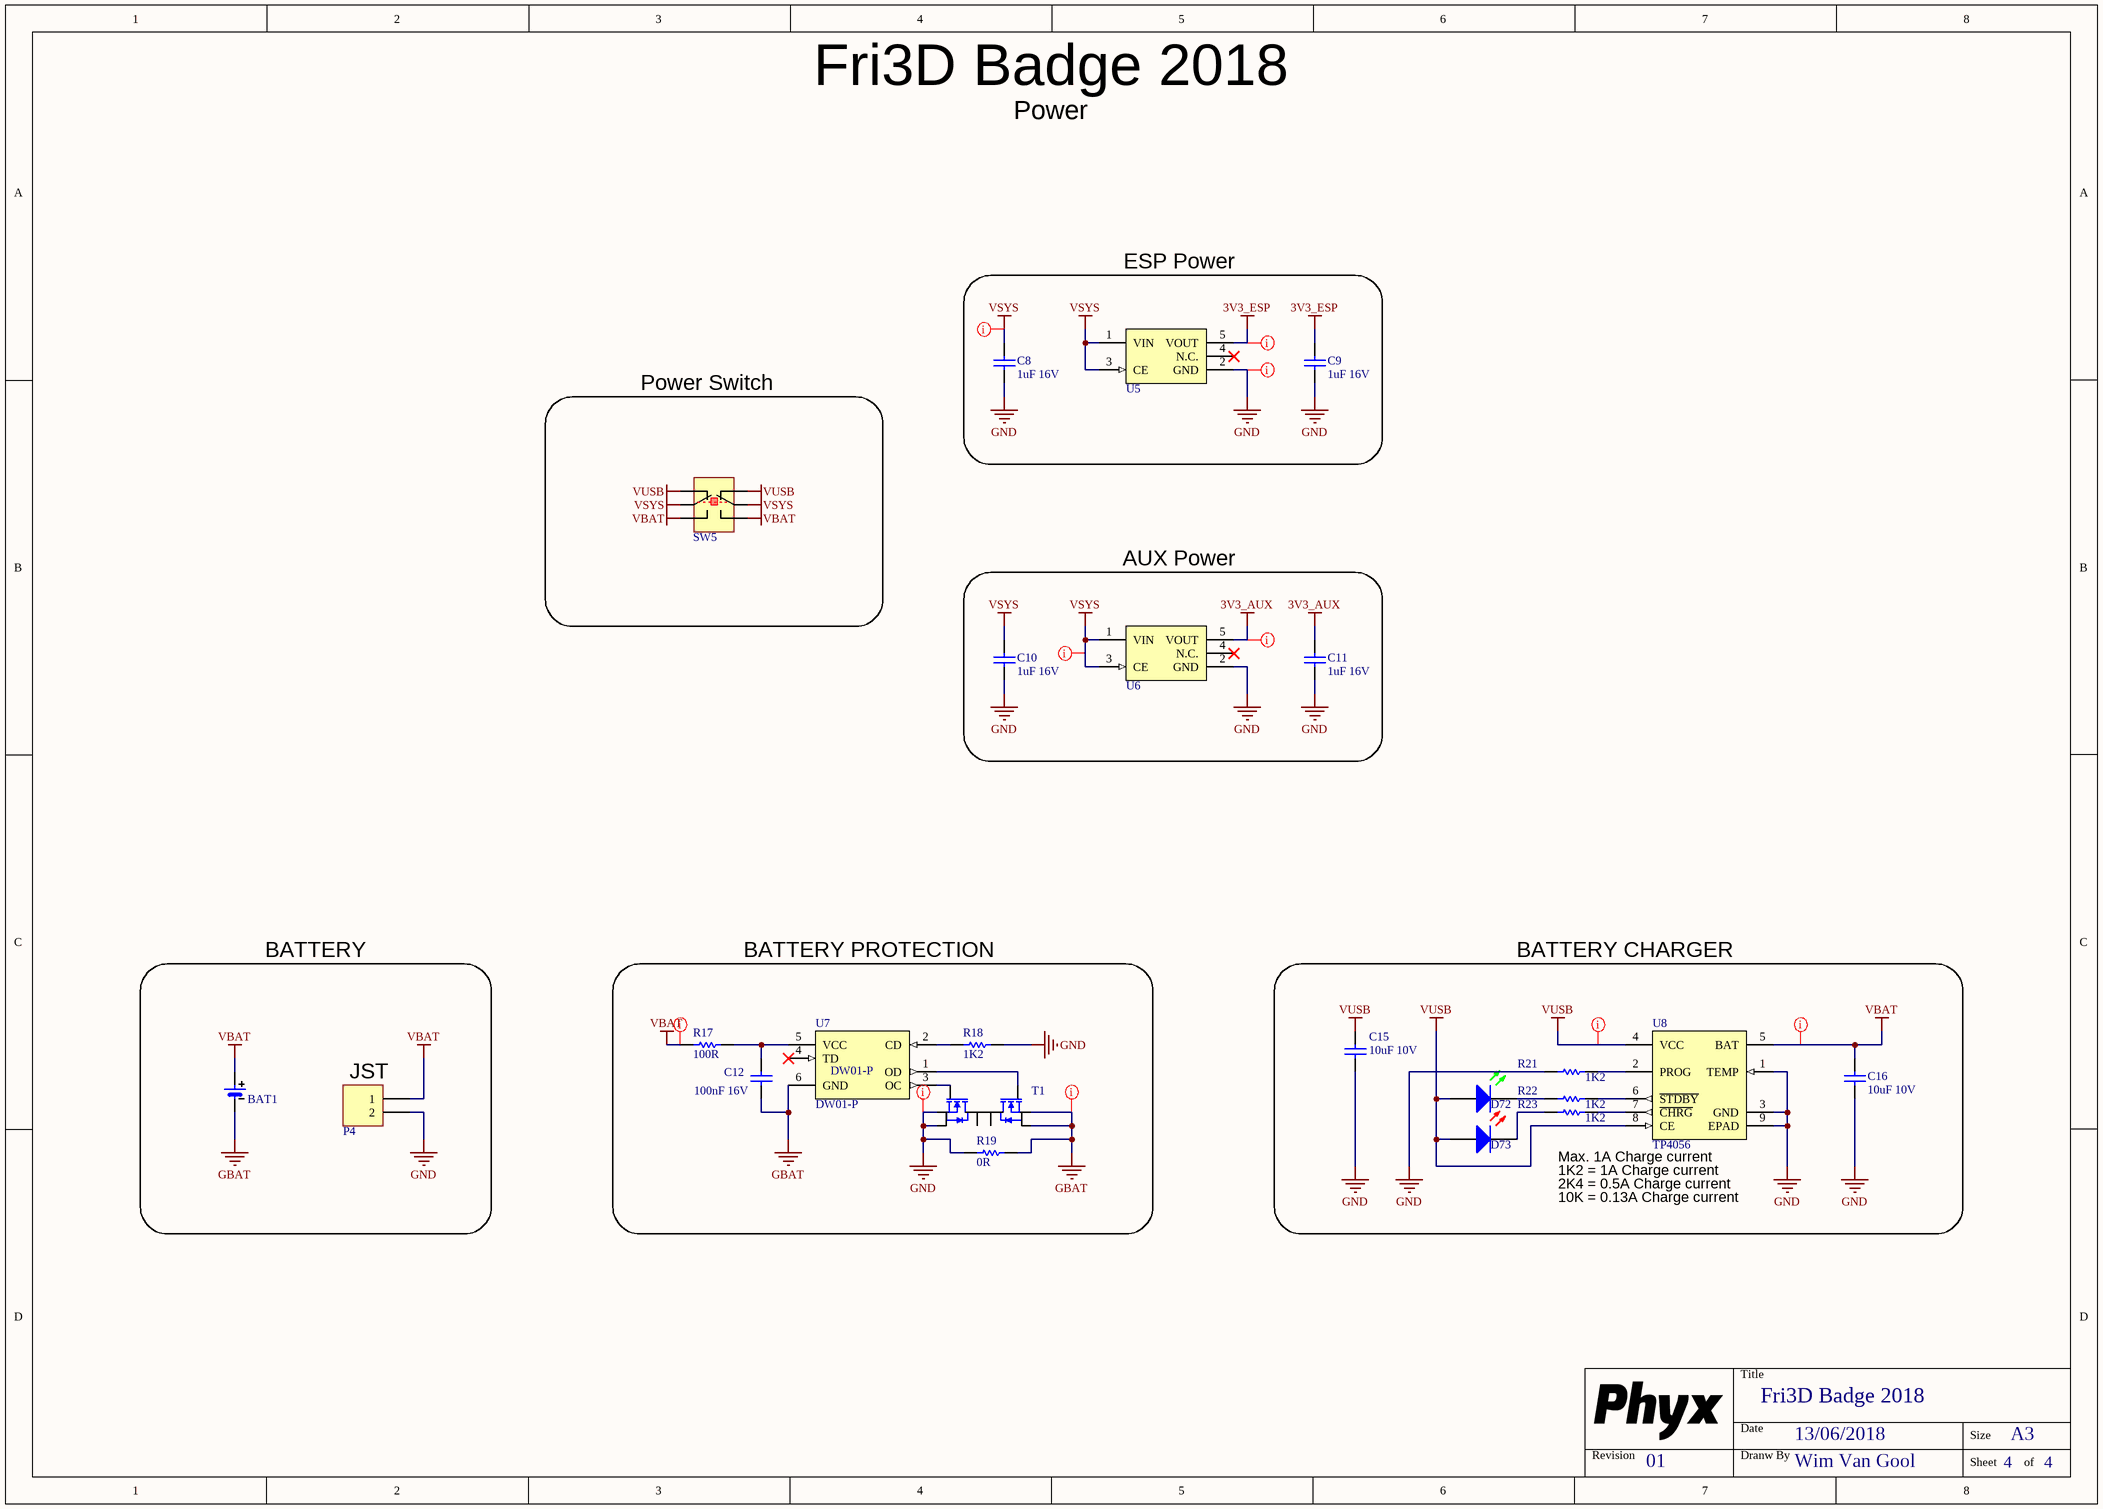
[diagram p3: Fri3D_2018_POWER_01.SchDoc]

### Parts
BAT1  18650 Battery holder  [MPD_BH-18650-PC]  (value not drawn)
C8  value 1uF 16V  [C0603_N]  (hidden comment: CAP_CERAMIC)
C9  value 1uF 16V  [C0603_N]  (hidden comment: CAP_CERAMIC)
C10  value 1uF 16V  [C0603_N]  (hidden comment: CAP_CERAMIC)
C11  value 1uF 16V  [C0603_N]  (hidden comment: CAP_CERAMIC)
C12  value 100nF 16V  [C0603_N]
C15  value 10uF 10V  [C0805_N]  (hidden comment: CAP_CERAMIC)
C16  value 10uF 10V  [C0805_N]  (hidden comment: CAP_CERAMIC)
D72  Default 0805 Green LED  [LED_0805_GR]  (value not drawn)
D73  Default 0805 Red LED  [LED_0805_RD]  (value not drawn)
P4  Header 2.0mm Shrouded 2  [WE_620102131822]  (value not drawn)
R17  value 100R  [R0603_N]  (hidden comment: RESISTOR)
R18  value 1K2  [R0603_N]  (hidden comment: RESISTOR)
R19  value 0R  [R0603_N]
R21  value 1K2  [R0603_N]  (hidden comment: RESISTOR)
R22  value 1K2  [R0603_N]  (hidden comment: RESISTOR)
R23  value 1K2  [R0603_N]  (hidden comment: RESISTOR)
SW5  Mini slide switch 2P2T  [MSS22D18]  (value not drawn)
T1  Dual N-Ch MOSFET Common Drain  [TSSOP_8_65P]  (value not drawn)
U5  3V3 LDO 700mA 50mV  [SOT23-5]  (value not drawn)
U6  3V3 LDO 700mA 50mV  [SOT23-5]  (value not drawn)
U7  value DW01-P  [SOT23-6]  (hidden comment: DW01-P single cell lithium protection)
U8  value TP4056  [SOIC_N_8_TH]  (hidden comment: Single Cell LiIon charger max 1A)

### Blocks framed on the sheet
ESP Power: C8 C9 U5
Power Switch: SW5
AUX Power: C10 C11 U6
BATTERY PROTECTION: C12 R17-R19 T1 U7
BATTERY CHARGER: C15 C16 D72 D73 R21-R23 U8

### Nets
3V3_AUX: C11.1 U6.5(VOUT)
3V3_ESP: C9.1 U5.5(VOUT)
GBAT: BAT1.2 C12.2 R19.1 T1.2(S1) T1.3(S1) U7.6(GND)
GND: C8.2 C9.2 C10.2 C11.2 C15.2 C16.2 P4.2 R18.2 R19.2 R21.2 T1.6(S2) T1.7(S2) U5.2(GND) U6.2(GND) U8.1(TEMP) U8.3(GND) U8.9(EPAD)
VBAT: BAT1.1 C16.1 P4.1 R17.1 SW5.5 SW5.6 U8.5(BAT)
VSYS: C8.1 C10.1 SW5.3 SW5.4 U5.1(VIN) U5.3(CE) U6.1(VIN) U6.3(CE)
VUSB: C15.1 D72.1(A) D73.1(A) SW5.1 SW5.2 U8.4(VCC) U8.8(CE)
NetC12_1: C12.1 R17.2 U7.5(VCC)
NetD72_2: D72.2(K) R22.1
NetD73_2: D73.2(K) R23.1
NetR18_1: R18.1 U7.2(CD)
NetR21_1: R21.1 U8.2(PROG)
NetR22_2: R22.2 U8.6(~{STDBY})
NetR23_2: R23.2 U8.7(~{CHRG})
NetT1_4: T1.4(G1) U7.1(OD)
NetT1_5: T1.5(G2) U7.3(OC)

Not connected (* = marked no-connect by the designer): T1 1(D1) 8(D2); U5 4(N.C.)*; U6 4(N.C.)*; U7 4(TD)*

### Layout directives
net class POWER: 3V3_AUX, 3V3_ESP, GBAT, GND, VBAT, VSYS, VUSB

### Notes on the sheet
- Fri3D Badge 2018
- Power
- BATTERY
- (near P4) JST
- 1K2 = 1A Charge current
- 2K4 = 0.5A Charge current
- Max. 1A Charge current
- 10K = 0.13A Charge current
- Title
- Revision
- Date
- Dranw By
- Size
- A3
- Sheet
- of

### Library data of the parts
BAT1 = 18650 Battery holder BH-18650-PC: =Description; Value: BH-18650-PC; Supplier 1: Digikey
C8-C11 = CAP # 1uF 16V 0603: Capacitor Ceramic; Supplier 1: Farnell; Supplier Part Number 1: 2320814
C12 = CAP # 100nF 16V 0603: Capacitor Ceramic
C15 C16 = CAP # 10uF 10V 0805: Capacitor Ceramic; Supplier 1: Farnell; Supplier Part Number 1: 2320859
D72 = LED # Green 0805: =Description; Supplier 1: Farnell; Supplier Part Number 1: 2099239
D73 = LED # Red 0805: =Description; Supplier 1: Farnell; Supplier Part Number 1: 2099236
P4 = HDR # SHR 2.0mm 2way - 620102131822: Value: 620102131822; Supplier 1: Wurth
R17 = RES # 100R 0603
R18 R21-R23 = RES # 1K2 0603
R19 = RES # 0R 0603: Supplier 1: Farnell; Supplier Part Number 1: 2447743
SW5 = SW # 2P2T mini slide MSS22D18: Value: MSS22D18; Supplier 1: AliExpress; Supplier Part Number 1: MSS22D18
T1 = FS8205A Dual N-Ch common Drain for DW01-P: =Description; Value: FS8205A; Supplier 1: AliExpress; Supplier Part Number 1: FS8205A
U5 U6 = LDO # 3V3 XC6210B33: =Designator; Value: XC6210B332MR; Supplier 1: Farnell; Supplier Part Number 1: 1057803
U7 = PWR # DW01-P Lithium protection: =Description; Supplier 1: Aliexpress; Supplier Part Number 1: DW01-P
U8 = CHG # TP4056 LiIon 1A: =Description; Supplier 1: Aliexpress; Supplier Part Number 1: TP4056

## Nets that join several sheets
3V3_AUX: Fri3D_2018_01 (16 pins), Fri3D_2018_CONTROLLER_01 (6 pins), Fri3D_2018_LEDS_01 (10 pins), Fri3D_2018_POWER_01 (C11.1 U6.5)
3V3_ESP: Fri3D_2018_CONTROLLER_01 (5 pins), Fri3D_2018_POWER_01 (C9.1 U5.5)
GND: Fri3D_2018_01 (32 pins), Fri3D_2018_CONTROLLER_01 (13 pins), Fri3D_2018_LEDS_01 (6 pins), Fri3D_2018_POWER_01 (17 pins)
VSYS: Fri3D_2018_01 (P1.8 P2.8 TP1.1), Fri3D_2018_POWER_01 (8 pins)
VUSB: Fri3D_2018_01 (D1.5 J2.1), Fri3D_2018_CONTROLLER_01 (7 pins), Fri3D_2018_POWER_01 (7 pins)
ACC.INT1: Fri3D_2018_01 (U1.8), Fri3D_2018_CONTROLLER_01 (MOD1.6 R36.2)
ACC.INT2: Fri3D_2018_01 (U1.9), Fri3D_2018_CONTROLLER_01 (MOD1.7 R35.2)
BTN.0: Fri3D_2018_01 (C13.1 SW4.1), Fri3D_2018_CONTROLLER_01 (MOD1.4 R40.2)
BTN.1: Fri3D_2018_01 (C21.1 SW3.1), Fri3D_2018_CONTROLLER_01 (MOD1.5 R39.2)
BUZZER: Fri3D_2018_01 (R31.1 T2.1), Fri3D_2018_CONTROLLER_01 (MOD1.9)
ESP.BOOT: Fri3D_2018_01 (C14.1 SW2.1), Fri3D_2018_CONTROLLER_01 (MOD1.25 R28.2 T4.3)
ESP.RESET: Fri3D_2018_01 (C22.1 SW1.1), Fri3D_2018_CONTROLLER_01 (MOD1.3 R29.2 T3.3)
I2C.SCL: Fri3D_2018_01 (MOD2.3 P1.1 P2.1 U1.14), Fri3D_2018_CONTROLLER_01 (MOD1.36 R2.2)
I2C.SDA: Fri3D_2018_01 (MOD2.4 P1.3 P2.3 U1.13), Fri3D_2018_CONTROLLER_01 (MOD1.33 R1.2)
PWM.0: Fri3D_2018_01 (P1.12), Fri3D_2018_CONTROLLER_01 (MOD1.8)
PWM.1: Fri3D_2018_01 (P1.10), Fri3D_2018_CONTROLLER_01 (MOD1.10)
PWM.2: Fri3D_2018_01 (P1.4), Fri3D_2018_CONTROLLER_01 (MOD1.11)
PWM.3: Fri3D_2018_01 (P1.2), Fri3D_2018_CONTROLLER_01 (MOD1.12)
SD.CLK: Fri3D_2018_01 (J1.5 R41.2), Fri3D_2018_CONTROLLER_01 (MOD1.30)
SD.CS: Fri3D_2018_01 (J1.2 R32.2), Fri3D_2018_CONTROLLER_01 (MOD1.29)
SD.DI: Fri3D_2018_01 (J1.3 R43.2), Fri3D_2018_CONTROLLER_01 (MOD1.37)
SD.DO: Fri3D_2018_01 (J1.7 R42.2), Fri3D_2018_CONTROLLER_01 (MOD1.31)
SR.DATA_IN: Fri3D_2018_CONTROLLER_01 (MOD1.24), Fri3D_2018_LEDS_01 (U2.14)
SR.~{OE}: Fri3D_2018_CONTROLLER_01 (MOD1.16), Fri3D_2018_LEDS_01 (R34.2 U2.13 U3.13 U4.13)
SR.RCLK: Fri3D_2018_CONTROLLER_01 (MOD1.23), Fri3D_2018_LEDS_01 (U2.12 U3.12 U4.12)
SR.SRCLK: Fri3D_2018_CONTROLLER_01 (MOD1.26), Fri3D_2018_LEDS_01 (U2.11 U3.11 U4.11)
TOUCH.0: Fri3D_2018_01 (TP6.1), Fri3D_2018_CONTROLLER_01 (R37.2)
TOUCH.1: Fri3D_2018_01 (P1.11 TP7.1), Fri3D_2018_CONTROLLER_01 (R38.2)
U1.RXD: Fri3D_2018_01 (P2.12), Fri3D_2018_CONTROLLER_01 (MOD1.13 R38.1)
U1.TXD: Fri3D_2018_01 (P2.10), Fri3D_2018_CONTROLLER_01 (MOD1.14 R37.1)
U2.RXD: Fri3D_2018_01 (P2.4), Fri3D_2018_CONTROLLER_01 (MOD1.27)
U2.TXD: Fri3D_2018_01 (P2.2), Fri3D_2018_CONTROLLER_01 (MOD1.28)
USB.D_n: Fri3D_2018_01 (D1.1 J2.2), Fri3D_2018_CONTROLLER_01 (U9.4)
USB.D_p: Fri3D_2018_01 (D1.6 J2.3), Fri3D_2018_CONTROLLER_01 (U9.3)

## Assembly variants
Not Mounted: not fitted C2 C13 C14 C21 C22 J1 MOD2 P1 P2 P2 P3 P3 P4 P4 P5 P5 P6 R19 R32 R41 R42 R43 TP1 TP2 TP3 TP4 TP6 TP7